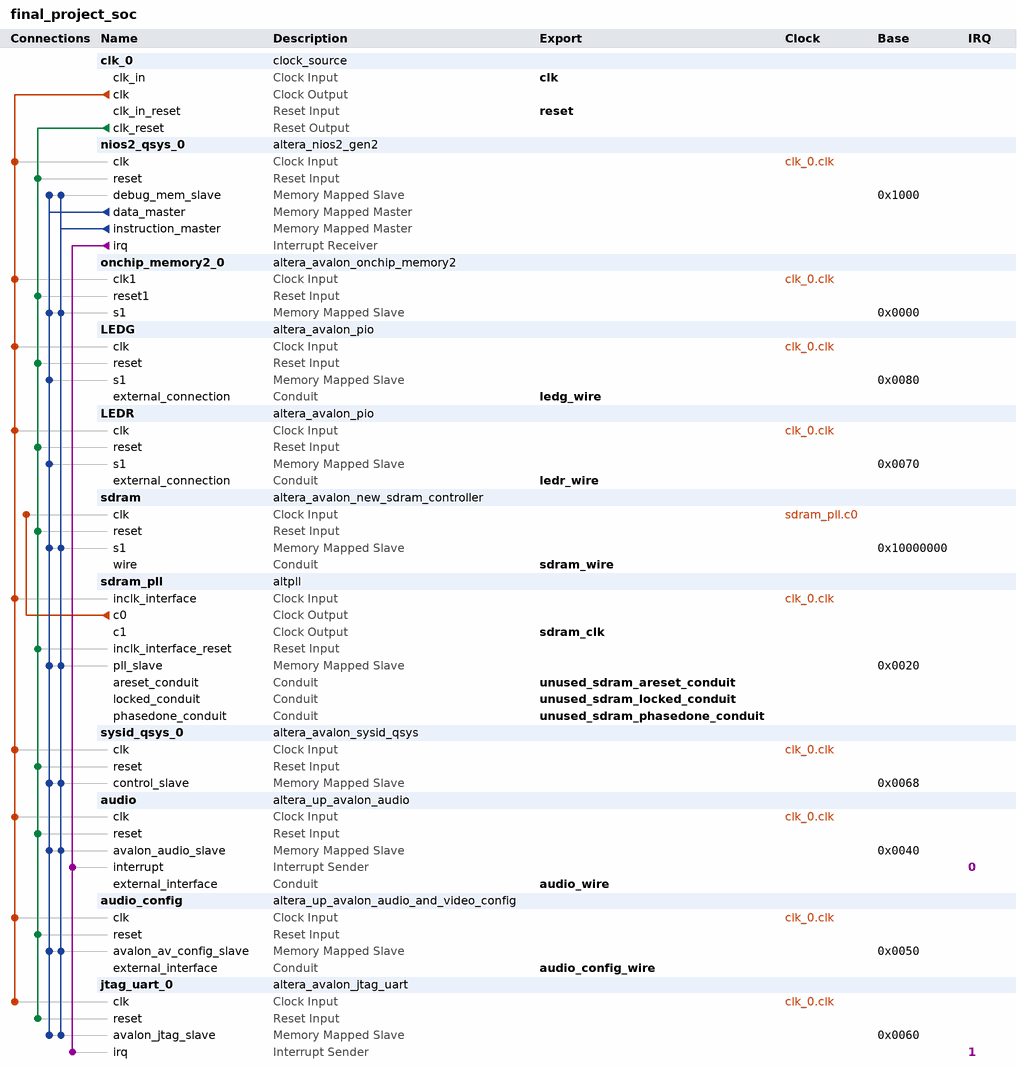
[diagram p0: system contents]
# Platform Designer (Qsys) system final_project_soc, Cyclone IV E EP4CE115F29C7
# Parameters at their usual value, and those the tool derives, are not listed.
package require -exact qsys 14.1
create_system final_project_soc
set_project_property DEVICE_FAMILY {Cyclone IV E}
set_project_property DEVICE EP4CE115F29C7

add_instance clk_0 clock_source 14.1
set_instance_parameter_value clk_0 clockFrequency 50000000

add_instance nios2_qsys_0 altera_nios2_gen2 14.1
set_instance_parameter_value nios2_qsys_0 dcache_size 2048
set_instance_parameter_value nios2_qsys_0 exceptionSlave sdram.s1
set_instance_parameter_value nios2_qsys_0 icache_size 4096
set_instance_parameter_value nios2_qsys_0 impl Tiny
set_instance_parameter_value nios2_qsys_0 resetSlave sdram.s1
set_instance_parameter_value nios2_qsys_0 setting_activateTrace true

add_instance onchip_memory2_0 altera_avalon_onchip_memory2 14.1
set_instance_parameter_value onchip_memory2_0 dataWidth 32
set_instance_parameter_value onchip_memory2_0 dualPort false
set_instance_parameter_value onchip_memory2_0 initMemContent true
set_instance_parameter_value onchip_memory2_0 initializationFileName onchip_mem.hex
set_instance_parameter_value onchip_memory2_0 memorySize 16

add_instance LEDG altera_avalon_pio 14.1
set_instance_parameter_value LEDG direction Output
set_instance_parameter_value LEDG width 8

add_instance LEDR altera_avalon_pio 14.1
set_instance_parameter_value LEDR direction Output
set_instance_parameter_value LEDR width 18

add_instance sdram altera_avalon_new_sdram_controller 14.1
set_instance_parameter_value sdram TAC 5.5
set_instance_parameter_value sdram TRCD 20.0
set_instance_parameter_value sdram TRP 20.0
set_instance_parameter_value sdram casLatency 3
set_instance_parameter_value sdram columnWidth 10
set_instance_parameter_value sdram dataWidth 32
set_instance_parameter_value sdram generateSimulationModel true
set_instance_parameter_value sdram model single_Micron_MT48LC4M32B2_7_chip
set_instance_parameter_value sdram numberOfBanks 4
set_instance_parameter_value sdram numberOfChipSelects 1
set_instance_parameter_value sdram powerUpDelay 200.0
set_instance_parameter_value sdram refreshPeriod 7.8125
set_instance_parameter_value sdram rowWidth 13

add_instance sdram_pll altpll 14.1
set_instance_parameter_value sdram_pll CLK0_DIVIDE_BY 1
set_instance_parameter_value sdram_pll CLK0_MULTIPLY_BY 1
set_instance_parameter_value sdram_pll CLK1_DIVIDE_BY 1
set_instance_parameter_value sdram_pll CLK1_DUTY_CYCLE 50
set_instance_parameter_value sdram_pll CLK1_MULTIPLY_BY 1
set_instance_parameter_value sdram_pll CLK1_PHASE_SHIFT -3000
set_instance_parameter_value sdram_pll INCLK0_INPUT_FREQUENCY 20000
set_instance_parameter_value sdram_pll PORT_ARESET PORT_UNUSED
set_instance_parameter_value sdram_pll PORT_LOCKED PORT_UNUSED
set_instance_parameter_value sdram_pll PORT_clk1 PORT_USED
set_instance_parameter_value sdram_pll PORT_clk2 PORT_UNUSED
set_instance_parameter_value sdram_pll PORT_clk3 PORT_UNUSED

add_instance sysid_qsys_0 altera_avalon_sysid_qsys 14.1
set_instance_parameter_value sysid_qsys_0 id 0

add_instance audio altera_up_avalon_audio 14.1
set_instance_parameter_value audio audio_in true
set_instance_parameter_value audio avalon_bus_type {Memory Mapped}
set_instance_parameter_value audio dw 16

add_instance audio_config altera_up_avalon_audio_and_video_config 14.1
set_instance_parameter_value audio_config audio_in {Line In to ADC}
set_instance_parameter_value audio_config bit_length 24
set_instance_parameter_value audio_config board DE2-115
set_instance_parameter_value audio_config line_in_bypass false
set_instance_parameter_value audio_config sampling_rate {48 kHz}

add_instance jtag_uart_0 altera_avalon_jtag_uart 14.1
set_instance_parameter_value jtag_uart_0 allowMultipleConnections true
set_instance_parameter_value jtag_uart_0 simInteractiveOptions NO_INTERACTIVE_WINDOWS

# connections
add_connection clk_0.clk audio.clk clock
add_connection clk_0.clk audio_config.clk clock
add_connection clk_0.clk jtag_uart_0.clk clock
add_connection clk_0.clk LEDG.clk clock
add_connection clk_0.clk LEDR.clk clock
add_connection clk_0.clk nios2_qsys_0.clk clock
add_connection clk_0.clk onchip_memory2_0.clk1 clock
add_connection clk_0.clk sdram_pll.inclk_interface clock
add_connection clk_0.clk sysid_qsys_0.clk clock
add_connection sdram_pll.c0 sdram.clk clock
add_connection clk_0.clk_reset audio.reset reset
add_connection clk_0.clk_reset audio_config.reset reset
add_connection clk_0.clk_reset jtag_uart_0.reset reset
add_connection clk_0.clk_reset LEDG.reset reset
add_connection clk_0.clk_reset LEDR.reset reset
add_connection clk_0.clk_reset nios2_qsys_0.reset reset
add_connection clk_0.clk_reset onchip_memory2_0.reset1 reset
add_connection clk_0.clk_reset sdram.reset reset
add_connection clk_0.clk_reset sdram_pll.inclk_interface_reset reset
add_connection clk_0.clk_reset sysid_qsys_0.reset reset
add_connection nios2_qsys_0.data_master audio.avalon_audio_slave avalon
set_connection_parameter_value nios2_qsys_0.data_master/audio.avalon_audio_slave baseAddress 0x0040
add_connection nios2_qsys_0.data_master audio_config.avalon_av_config_slave avalon
set_connection_parameter_value nios2_qsys_0.data_master/audio_config.avalon_av_config_slave baseAddress 0x0050
add_connection nios2_qsys_0.data_master jtag_uart_0.avalon_jtag_slave avalon
set_connection_parameter_value nios2_qsys_0.data_master/jtag_uart_0.avalon_jtag_slave baseAddress 0x0060
add_connection nios2_qsys_0.data_master LEDG.s1 avalon
set_connection_parameter_value nios2_qsys_0.data_master/LEDG.s1 baseAddress 0x0080
add_connection nios2_qsys_0.data_master LEDR.s1 avalon
set_connection_parameter_value nios2_qsys_0.data_master/LEDR.s1 baseAddress 0x0070
add_connection nios2_qsys_0.data_master nios2_qsys_0.debug_mem_slave avalon
set_connection_parameter_value nios2_qsys_0.data_master/nios2_qsys_0.debug_mem_slave baseAddress 0x1000
add_connection nios2_qsys_0.data_master onchip_memory2_0.s1 avalon
set_connection_parameter_value nios2_qsys_0.data_master/onchip_memory2_0.s1 baseAddress 0x0000
add_connection nios2_qsys_0.data_master sdram.s1 avalon
set_connection_parameter_value nios2_qsys_0.data_master/sdram.s1 baseAddress 0x10000000
add_connection nios2_qsys_0.data_master sdram_pll.pll_slave avalon
set_connection_parameter_value nios2_qsys_0.data_master/sdram_pll.pll_slave baseAddress 0x0020
add_connection nios2_qsys_0.data_master sysid_qsys_0.control_slave avalon
set_connection_parameter_value nios2_qsys_0.data_master/sysid_qsys_0.control_slave baseAddress 0x0068
add_connection nios2_qsys_0.instruction_master audio.avalon_audio_slave avalon
set_connection_parameter_value nios2_qsys_0.instruction_master/audio.avalon_audio_slave baseAddress 0x0040
add_connection nios2_qsys_0.instruction_master audio_config.avalon_av_config_slave avalon
set_connection_parameter_value nios2_qsys_0.instruction_master/audio_config.avalon_av_config_slave baseAddress 0x0050
add_connection nios2_qsys_0.instruction_master jtag_uart_0.avalon_jtag_slave avalon
set_connection_parameter_value nios2_qsys_0.instruction_master/jtag_uart_0.avalon_jtag_slave baseAddress 0x0060
add_connection nios2_qsys_0.instruction_master nios2_qsys_0.debug_mem_slave avalon
set_connection_parameter_value nios2_qsys_0.instruction_master/nios2_qsys_0.debug_mem_slave baseAddress 0x1000
add_connection nios2_qsys_0.instruction_master onchip_memory2_0.s1 avalon
set_connection_parameter_value nios2_qsys_0.instruction_master/onchip_memory2_0.s1 baseAddress 0x0000
add_connection nios2_qsys_0.instruction_master sdram.s1 avalon
set_connection_parameter_value nios2_qsys_0.instruction_master/sdram.s1 baseAddress 0x10000000
add_connection nios2_qsys_0.instruction_master sdram_pll.pll_slave avalon
set_connection_parameter_value nios2_qsys_0.instruction_master/sdram_pll.pll_slave baseAddress 0x0020
add_connection nios2_qsys_0.instruction_master sysid_qsys_0.control_slave avalon
set_connection_parameter_value nios2_qsys_0.instruction_master/sysid_qsys_0.control_slave baseAddress 0x0068
add_connection nios2_qsys_0.irq audio.interrupt interrupt
set_connection_parameter_value nios2_qsys_0.irq/audio.interrupt irqNumber 0
add_connection nios2_qsys_0.irq jtag_uart_0.irq interrupt
set_connection_parameter_value nios2_qsys_0.irq/jtag_uart_0.irq irqNumber 1

# exported interfaces
add_interface audio_config_wire conduit end
set_interface_property audio_config_wire EXPORT_OF audio_config.external_interface
add_interface audio_wire conduit end
set_interface_property audio_wire EXPORT_OF audio.external_interface
add_interface clk clock sink
set_interface_property clk EXPORT_OF clk_0.clk_in
add_interface ledg_wire conduit end
set_interface_property ledg_wire EXPORT_OF LEDG.external_connection
add_interface ledr_wire conduit end
set_interface_property ledr_wire EXPORT_OF LEDR.external_connection
add_interface reset reset sink
set_interface_property reset EXPORT_OF clk_0.clk_in_reset
add_interface sdram_clk clock source
set_interface_property sdram_clk EXPORT_OF sdram_pll.c1
add_interface sdram_wire conduit end
set_interface_property sdram_wire EXPORT_OF sdram.wire
add_interface unused_sdram_areset_conduit conduit end
set_interface_property unused_sdram_areset_conduit EXPORT_OF sdram_pll.areset_conduit
add_interface unused_sdram_locked_conduit conduit end
set_interface_property unused_sdram_locked_conduit EXPORT_OF sdram_pll.locked_conduit
add_interface unused_sdram_phasedone_conduit conduit end
set_interface_property unused_sdram_phasedone_conduit EXPORT_OF sdram_pll.phasedone_conduit

set_interconnect_requirement {$system} qsys_mm.clockCrossingAdapter HANDSHAKE
set_interconnect_requirement {$system} qsys_mm.insertDefaultSlave FALSE
set_interconnect_requirement {$system} qsys_mm.maxAdditionalLatency 1

save_system final_project_soc.qsys
